# Altium schematic sheet KeeWatch_External_Attachment.SchDoc
size 215 x 100 mm
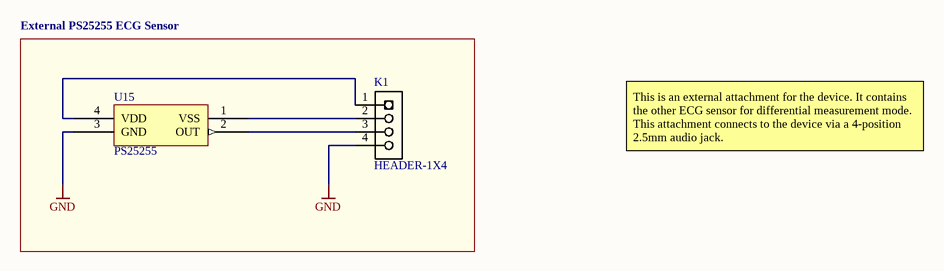
[diagram p0: KeeWatch_External_Attachment.SchDoc]

## Parts
K1  HEADER-1X4  [HEADER-1X4]
U15  PS25255  [PS25255]

## Blocks framed on the sheet
External PS25255 ECG Sensor: K1 U15

## Nets
GND: K1.4 U15.3(GND)
NetK1_1: K1.1 U15.4(VDD)
NetK1_2: K1.2 U15.1(VSS)
NetK1_3: K1.3 U15.2(OUT)

## Notes on the sheet
- This is an external attachment for the device. It contains the other ECG sensor for differential measurement mode. This attachment connects to the device via a 4-position 2.5mm audio jack.

## Library data of the parts
U15 = PS25255: EPIC Ultra High Impedance ECG Senso
K1 = HEADER-1X4: Supplier 1: Digi-Key; Supplier Part Number 1: S1011E-36-ND